# Altium schematic sheet main.SchDoc
size A4; SheetNumber: 1; SheetTotal: 13
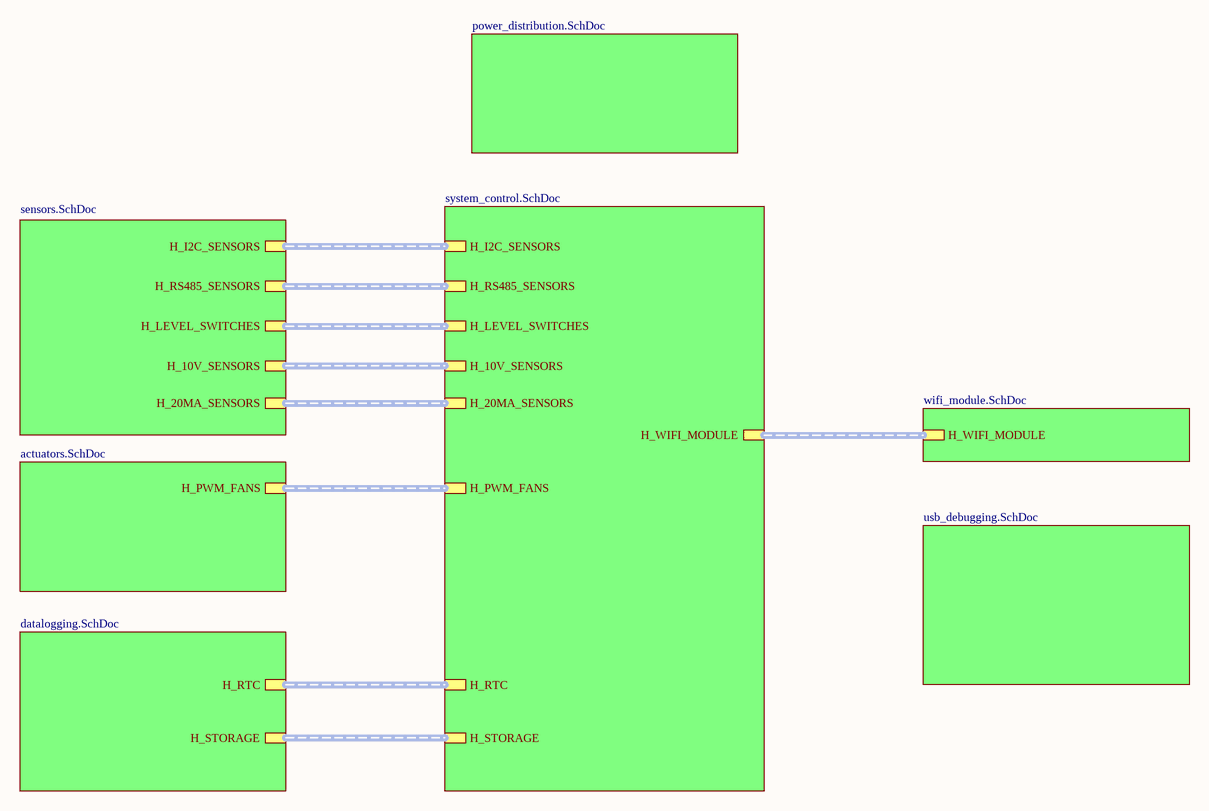
[diagram p0: main.SchDoc]

## Sub-sheets
actuators = actuators.SchDoc: H_PWM_FANS (harness H_PWM_FANS)
datalogging = datalogging.SchDoc: H_RTC (harness H_RTC), H_STORAGE (harness H_STORAGE)
power_distribution = power_distribution.SchDoc: no entries
sensors = sensors.SchDoc: H_I2C_SENSORS (harness H_I2C_SENSORS), H_LEVEL_SWITCHES (harness H_LEVEL_SENSORS), H_RS485_SENSORS, H_10V_SENSORS (harness H_ANALOG_SENSORS), H_20MA_SENSORS (harness H_ANALOG_SENSORS)
system_control = system_control.SchDoc: H_I2C_SENSORS (harness H_I2C_SENSORS), H_LEVEL_SWITCHES (harness H_LEVEL_SWITCHES), H_RTC (harness H_RTC), H_STORAGE (harness H_STORAGE), H_RS485_SENSORS (harness H_RS485_SENSORS), H_10V_SENSORS (harness H_10V_SENSORS), H_20MA_SENSORS (harness H_20MA_SENSORS), H_PWM_FANS (harness H_PWM_FANS), H_WIFI_MODULE (harness H_WIFI_MODULE)
usb_debugging = usb_debugging.SchDoc: no entries
wifi_module = wifi_module.SchDoc: H_WIFI_MODULE (harness H_WIFI_MODULE)

## Buses and harness runs
harness sheet actuators/H_PWM_FANS = sheet system_control/H_PWM_FANS
harness sheet datalogging/H_RTC = sheet system_control/H_RTC
harness sheet datalogging/H_STORAGE = sheet system_control/H_STORAGE
harness sheet sensors/H_10V_SENSORS = sheet system_control/H_10V_SENSORS
harness sheet sensors/H_20MA_SENSORS = sheet system_control/H_20MA_SENSORS
harness sheet sensors/H_I2C_SENSORS = sheet system_control/H_I2C_SENSORS
harness sheet sensors/H_LEVEL_SWITCHES = sheet system_control/H_LEVEL_SWITCHES
harness sheet sensors/H_RS485_SENSORS = sheet system_control/H_RS485_SENSORS
harness sheet system_control/H_WIFI_MODULE = sheet wifi_module/H_WIFI_MODULE